# EAGLE schematic main (EAGLE 6.6.0)
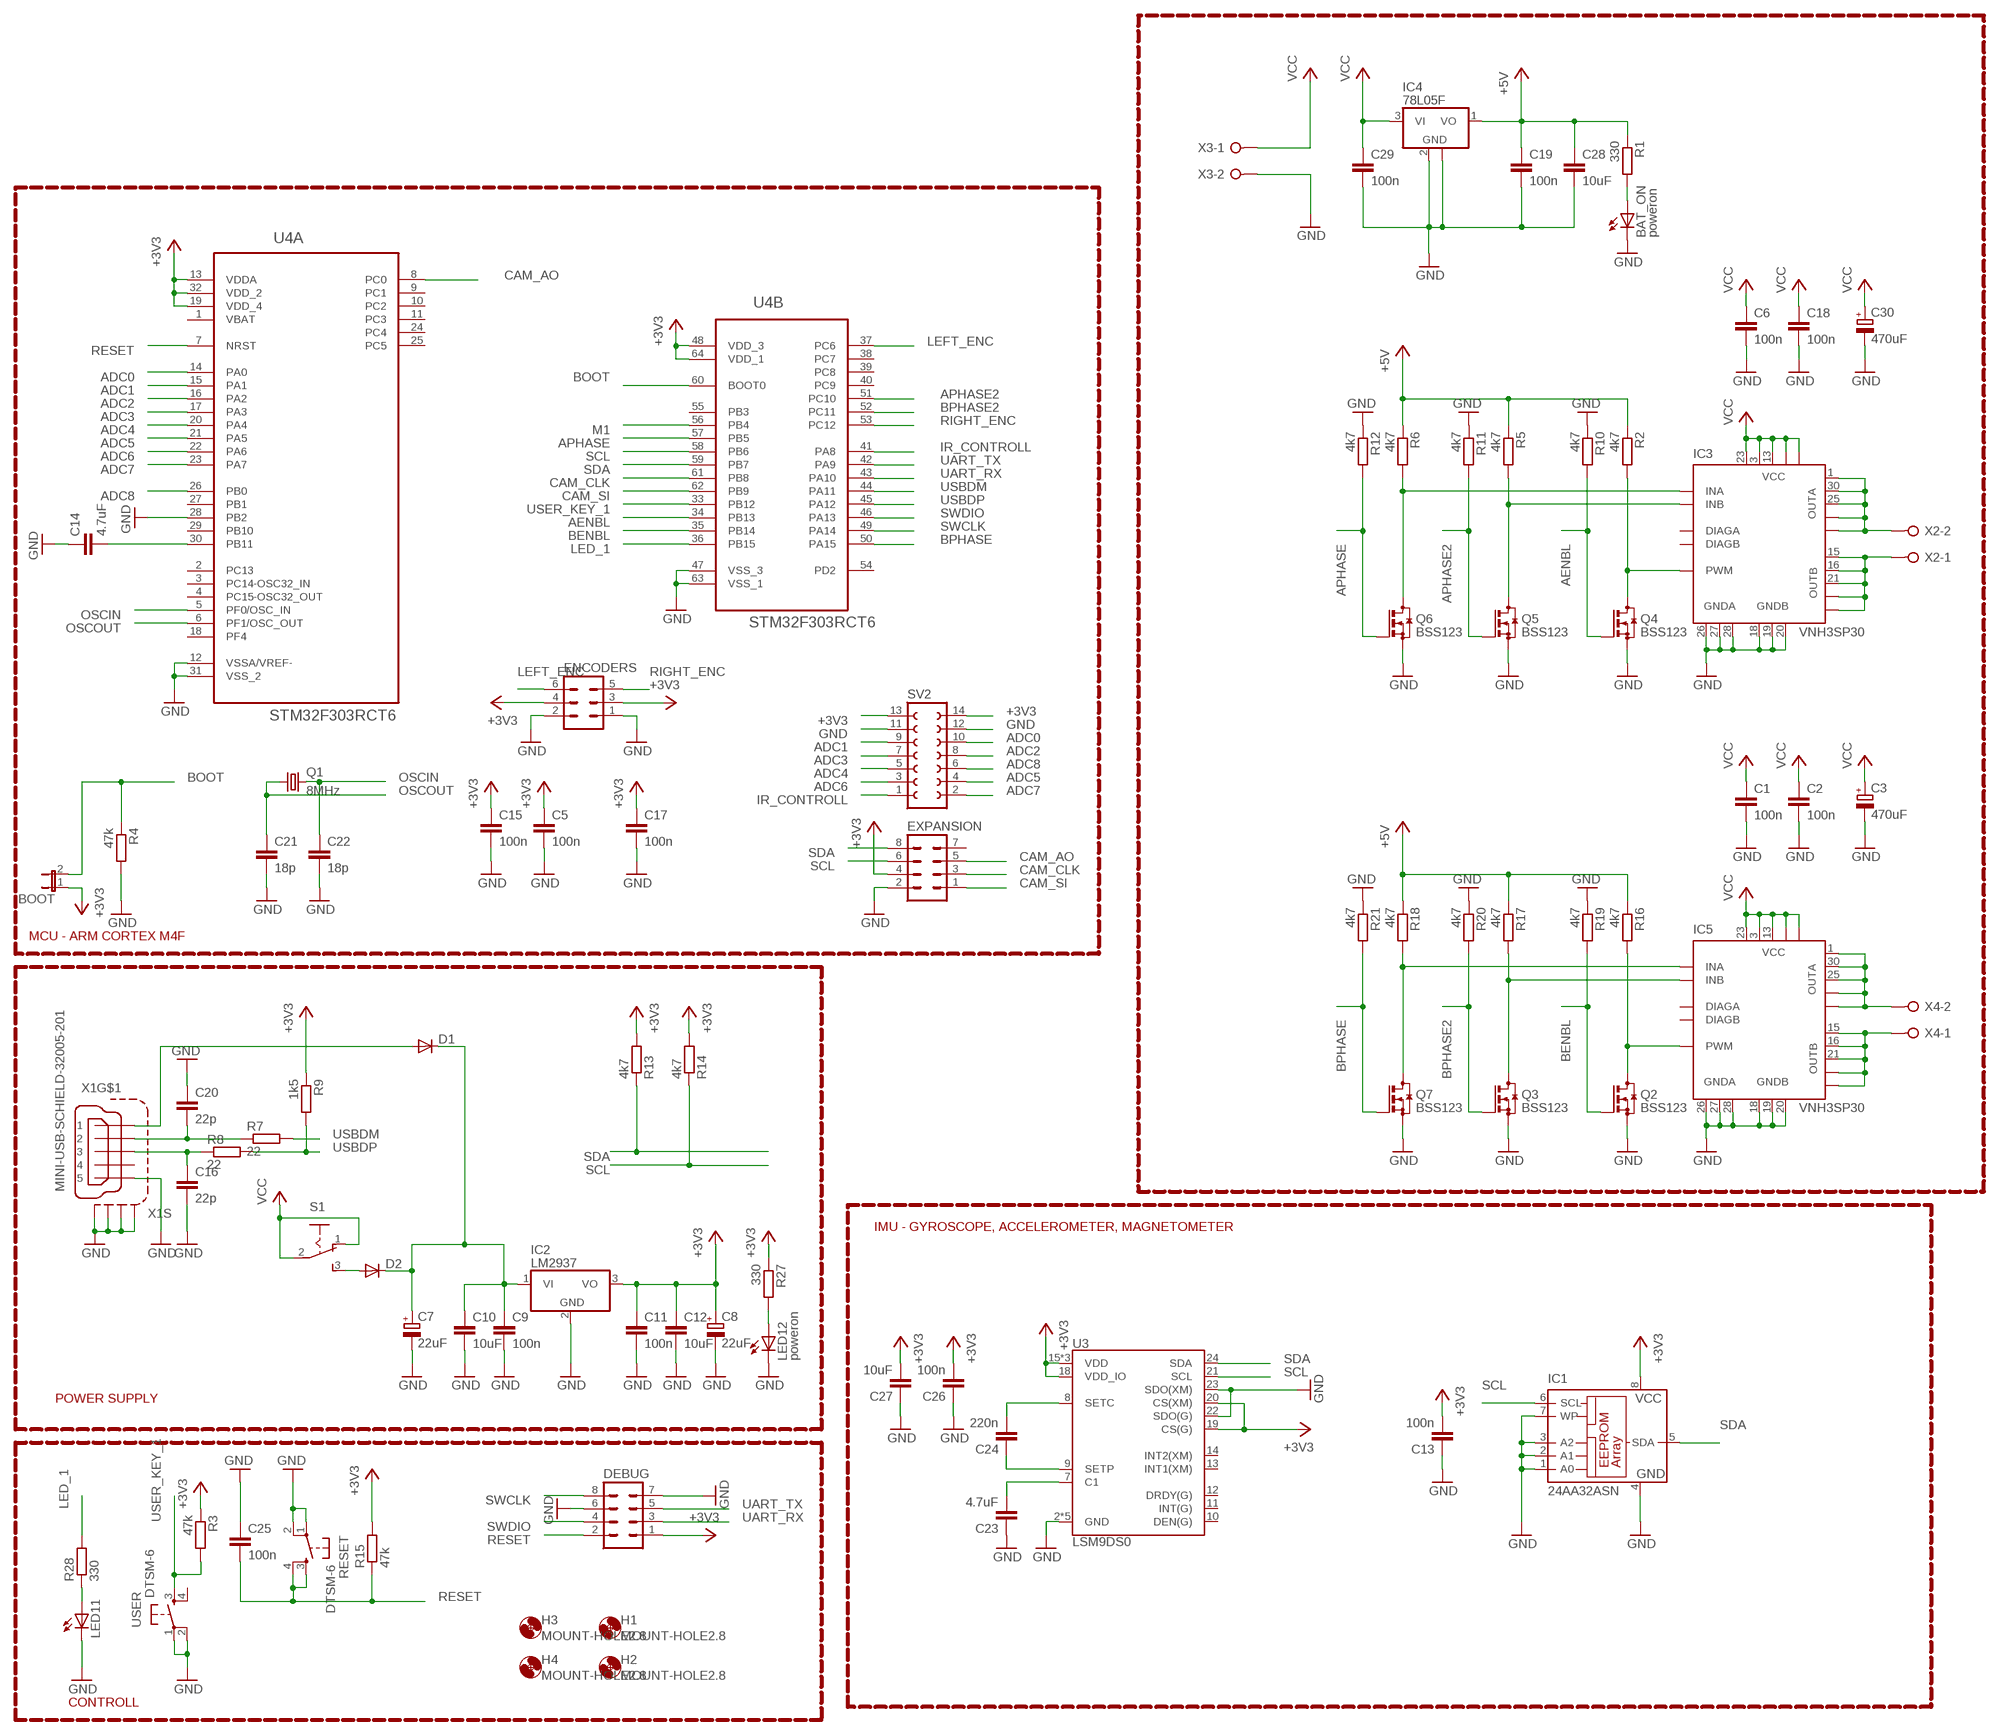
[diagram p0: schematic, sheet 1]

## Parts
BAT_ON  poweron  LEDCHIPLED_1206  [CHIPLED_1206]
BOOT  JP1E  [JP1]
C1  100n  C-EUC0805  [C0805]
C2  100n  C-EUC0805  [C0805]
C3  470uF  CPOL-EU140CLH-1014  [140CLH-1014]
C5  100n  C-EUC0805  [C0805]
C6  100n  C-EUC0805  [C0805]
C7  22uF  CPOL-EU153CLV-0505  [153CLV-0505]
C8  22uF  CPOL-EU153CLV-0505  [153CLV-0505]
C9  100n  C-EUC0805  [C0805]
C10  10uF  C-EUC0805  [C0805]
C11  100n  C-EUC0805  [C0805]
C12  10uF  C-EUC0805  [C0805]
C13  100n  C-EUC0805  [C0805]
C14  4.7uF  C-EUC0805  [C0805]
C15  100n  C-EUC0805  [C0805]
C16  22p  C-EUC0805  [C0805]
C17  100n  C-EUC0805  [C0805]
C18  100n  C-EUC0805  [C0805]
C19  100n  C-EUC0805  [C0805]
C20  22p  C-EUC0805  [C0805]
C21  18p  C-EUC0805  [C0805]
C22  18p  C-EUC0805  [C0805]
C23  4.7uF  C-EUC0805  [C0805]
C24  220n  C-EUC0805  [C0805]
C25  100n  C-EUC0805  [C0805]
C26  100n  C-EUC0805  [C0805]
C27  10uF  C-EUC0805  [C0805]
C28  10uF  C-EUC0805  [C0805]
C29  100n  C-EUC0805  [C0805]
C30  470uF  CPOL-EU140CLH-1014  [140CLH-1014]
D1  DIODE-SMB  [SMB]
D2  DIODE-SMB  [SMB]
DEBUG  MA04-2  [MA04-2]
ENCODERS  MA03-2  [MA03-2]
EXPANSION  MA04-2  [MA04-2]
H1  MOUNT-HOLE2.8  [2,8]
H2  MOUNT-HOLE2.8  [2,8]
H3  MOUNT-HOLE2.8  [2,8]
H4  MOUNT-HOLE2.8  [2,8]
IC1  24AA32ASN  [SO-08]
IC2  LM2937  [TO263-3]
IC3  VNH3SP30  [MULTIPOWERSO-30]
IC4  78L05F  [SOT89]
IC5  VNH3SP30  [MULTIPOWERSO-30]
LED11  LEDCHIPLED_1206  [CHIPLED_1206]
LED12  poweron  LEDCHIPLED_1206  [CHIPLED_1206]
Q1  8MHz  CRYSTALCTS406  [CTS406]
Q2  BSS123  [SOT23]
Q3  BSS123  [SOT23]
Q4  BSS123  [SOT23]
Q5  BSS123  [SOT23]
Q6  BSS123  [SOT23]
Q7  BSS123  [SOT23]
R1  330  R-EU_M0805  [M0805]
R2  4k7  R-EU_M0805  [M0805]
R3  47k  R-EU_M0805  [M0805]
R4  47k  R-EU_M0805  [M0805]
R5  4k7  R-EU_M0805  [M0805]
R6  4k7  R-EU_M0805  [M0805]
R7  22  R-EU_M0805  [M0805]
R8  22  R-EU_M0805  [M0805]
R9  1k5  R-EU_M0805  [M0805]
R10  4k7  R-EU_M0805  [M0805]
R11  4k7  R-EU_M0805  [M0805]
R12  4k7  R-EU_M0805  [M0805]
R13  4k7  R-EU_M0805  [M0805]
R14  4k7  R-EU_M0805  [M0805]
R15  47k  R-EU_M0805  [M0805]
R16  4k7  R-EU_M0805  [M0805]
R17  4k7  R-EU_M0805  [M0805]
R18  4k7  R-EU_M0805  [M0805]
R19  4k7  R-EU_M0805  [M0805]
R20  4k7  R-EU_M0805  [M0805]
R21  4k7  R-EU_M0805  [M0805]
R27  330  R-EU_M0805  [M0805]
R28  330  R-EU_M0805  [M0805]
RESET  DTSM-6  [DTSM-6]
S1  255SB  [255SB]
SV2  FE07-2  [FE07-2]
U3  LSM9DS0  [LGA-24]
U4  STM32F303RCT6  [QFP50P1200X1200X160-64N]
USER  DTSM-6  [DTSM-6]
X1  MINI-USB-SCHIELD-32005-201  [32005-201]
X2  W237-02P  [W237-132]
X3  W237-02P  [W237-132]
X4  W237-02P  [W237-132]

## Nets
+3V3: BOOT.1 C5.1 C8.+ C11.1 C12.1 C13.2 C15.1 C17.1 C26.2 C27.2 DEBUG.1 ENCODERS.3 ENCODERS.4 EXPANSION.4 IC1.8(VCC) IC2.3(VO) R3.1 R9.1 R13.2 R14.2 R15.2 R27.1 SV2.13 SV2.14 U3.15(VDD) U3.16(VDD) U3.17(VDD) U3.18(VDD_IO) U3.19(CS(G)) U3.20(CS(XM)) U4.13(A:VDDA) U4.19(A:VDD_4) U4.32(A:VDD_2) U4.48(B:VDD_3) U4.64(B:VDD_1)
+5V: C19.1 C28.1 IC4.1(VO) R1.1 R2.1 R5.1 R6.1 R16.1 R17.1 R18.1
ADC0: SV2.10 U4.14(A:PA0)
ADC1: SV2.9 U4.15(A:PA1)
ADC2: SV2.8 U4.16(A:PA2)
ADC3: SV2.7 U4.17(A:PA3)
ADC4: SV2.5 U4.20(A:PA4)
ADC5: SV2.4 U4.21(A:PA5)
ADC6: SV2.3 U4.22(A:PA6)
ADC7: SV2.2 U4.23(A:PA7)
ADC8: SV2.6 U4.26(A:PB0)
AENBL: Q4.1(G) R10.2 U4.34(B:PB13)
APHASE: Q6.1(G) R12.2 U4.57(B:PB5)
APHASE2: Q5.1(G) R11.2 U4.51(B:PC10)
BENBL: Q2.1(G) R19.2 U4.35(B:PB14)
BOOT: BOOT.2 R4.1 U4.60(B:BOOT0)
BPHASE: Q7.1(G) R21.2 U4.50(B:PA15)
BPHASE2: Q3.1(G) R20.2 U4.52(B:PC11)
CAM_AO: EXPANSION.5 U4.8(A:PC0)
CAM_CLK: EXPANSION.3 U4.61(B:PB8)
CAM_SI: EXPANSION.1 U4.62(B:PB9)
GND: BAT_ON.C C1.2 C2.2 C3.- C5.2 C6.2 C7.- C8.- C9.2 C10.2 C11.2 C12.2 C13.1 C14.1 C15.2 C16.2 C17.2 C18.2 C19.2 C20.1 C21.2 C22.2 C23.1 C25.1 C26.1 C27.1 C28.2 C29.2 C30.- DEBUG.6 DEBUG.7 ENCODERS.1 ENCODERS.2 EXPANSION.2 IC1.1(A0) IC1.2(A1) IC1.3(A2) IC1.4(GND) IC1.7(WP) IC2.2(GND) IC3.18(GNDB) IC3.19(GNDB) IC3.20(GNDB) IC3.26(GNDA) IC3.27(GNDA) IC3.28(GNDA) IC4.2(GND) IC4.2@1(GND) IC5.18(GNDB) IC5.19(GNDB) IC5.20(GNDB) IC5.26(GNDA) IC5.27(GNDA) IC5.28(GNDA) LED11.C LED12.C Q2.2(S) Q3.2(S) Q4.2(S) Q5.2(S) Q6.2(S) Q7.2(S) R4.2 R10.1 R11.1 R12.1 R19.1 R20.1 R21.1 RESET.1 RESET.2 SV2.11 SV2.12 U3.2(GND) U3.3(GND) U3.4(GND) U3.5(GND) U3.6(GND) U3.22(SDO(G)) U3.23(SDO(XM)) U4.12(A:VSSA/VREF-) U4.28(A:PB2) U4.31(A:VSS_2) U4.47(B:VSS_3) U4.63(B:VSS_1) USER.1 USER.2 X1.5 X1.M1(S:S1) X1.M2(S:S2) X1.M3(S:S3) X1.M4(S:S4) X3.2
IR_CONTROLL: SV2.1 U4.41(B:PA8)
LED_1: R28.2 U4.36(B:PB15)
LEFT_ENC: ENCODERS.6 U4.37(B:PC6)
M1: U4.56(B:PB4)
N$1: D2.A S1.3(S)
N$2: C7.+ C9.1 C10.1 D1.C D2.C IC2.1(VI)
N$3: BAT_ON.A R1.2
N$4: IC5.5(INA) Q7.3(D) R18.2
N$5: IC5.11(INB) Q3.3(D) R17.2
N$6: C23.2 U3.7(C1)
N$7: C24.2 U3.8(SETC)
N$8: IC5.8(PWM) Q2.3(D) R16.2
N$9: IC5.1(OUTA) IC5.25(OUTA) IC5.30(OUTA) IC5.OUTA IC5.OUTA@1(OUTA) X4.2
N$13: C24.1 U3.9(SETP)
N$14: IC5.15(OUTB) IC5.16(OUTB) IC5.21(OUTB) IC5.OUTB IC5.OUTB@1(OUTB) X4.1
N$15: C14.2 U4.30(A:PB11)
N$18: IC3.5(INA) Q6.3(D) R6.2
N$19: IC3.11(INB) Q5.3(D) R5.2
N$20: IC3.8(PWM) Q4.3(D) R2.2
N$21: IC3.1(OUTA) IC3.25(OUTA) IC3.30(OUTA) IC3.OUTA IC3.OUTA@1(OUTA) X2.2
N$23: LED12.A R27.2
N$24: IC3.15(OUTB) IC3.16(OUTB) IC3.21(OUTB) IC3.OUTB IC3.OUTB@1(OUTB) X2.1
N$33: LED11.A R28.1
N$55: C20.2 R7.1 X1.2
N$56: C16.1 R8.1 X1.3
N$57: D1.A X1.1
OSCIN: C22.1 Q1.3 U4.5(A:PF0/OSC_IN)
OSCOUT: C21.1 Q1.1 U4.6(A:PF1/OSC_OUT)
RESET: C25.2 DEBUG.2 R15.1 RESET.3 RESET.4 U4.7(A:NRST)
RIGHT_ENC: ENCODERS.5 U4.53(B:PC12)
SCL: EXPANSION.6 IC1.6(SCL) R14.1 U3.21(SCL) U4.58(B:PB6)
SDA: EXPANSION.8 IC1.5(SDA) R13.1 U3.24(SDA) U4.59(B:PB7)
SWCLK: DEBUG.8 U4.49(B:PA14)
SWDIO: DEBUG.4 U4.46(B:PA13)
UART_RX: DEBUG.3 U4.43(B:PA10)
UART_TX: DEBUG.5 U4.42(B:PA9)
USBDM: R7.2 U4.44(B:PA11)
USBDP: R8.2 R9.2 U4.45(B:PA12)
USER_KEY_1: R3.2 U4.33(B:PB12) USER.3
VCC: C1.1 C2.1 C3.+ C6.1 C18.1 C29.1 C30.+ IC3.3(VCC) IC3.13(VCC) IC3.23(VCC) IC3.VCC IC3.VCC@1(VCC) IC4.3(VI) IC5.3(VCC) IC5.13(VCC) IC5.23(VCC) IC5.VCC IC5.VCC@1(VCC) S1.1(O) S1.2(P) X3.1
Unconnected: EXPANSION.7 IC3.6(DIAGA) IC3.10(DIAGB) IC5.6(DIAGA) IC5.10(DIAGB) U3.10(DEN(G)) U3.11(INT(G)) U3.12(DRDY(G)) U3.13(INT1(XM)) U3.14(INT2(XM)) U4.2(A:PC13) U4.3(A:PC14-OSC32_IN) U4.4(A:PC15-OSC32_OUT) U4.9(A:PC1) U4.10(A:PC2) U4.11(A:PC3) U4.18(A:PF4) U4.24(A:PC4) U4.25(A:PC5) U4.27(A:PB1) U4.29(A:PB10) U4.38(B:PC7) U4.39(B:PC8) U4.40(B:PC9) U4.54(B:PD2) U4.55(B:PB3) USER.4 X1.4

## Notes on the sheet
- MCU - ARM CORTEX M4F
- IMU - GYROSCOPE, ACCELEROMETER, MAGNETOMETER
- POWER SUPPLY
- CONTROLL

## Power pins joined to a net without a drawn wire
VBAT: U4.1(A:VBAT)

## Library data of the parts
BAT_ON LED11 LED12 = led:LED: LED OSRAM: - CHIPLED LG R971, LG N971, LY N971, LG Q971, LY Q971, LO R971, LY R971 LH N974, LH R974 LS Q976, LO Q976, LY Q976 LO Q996 - Hyper CHIPLED LW Q18S LB Q993, LB Q99A, LB R99A - SideLED LS A670, LO A670, LY A670, LG A670, LP A670 LB A673, LV A673, LT A673, LW A673 LH A674 LY A675 LS A676, LA A676, LO A676, LY A676, LW A676 LS A679, LY A679, LG A679 - Hyper Micro SIDELED® LS Y876, LA Y876, LO Y876, LY Y876 LT Y87S - SmartLED LW L88C, LW L88S LB L89C, LB L89S, LG L890 LS L89K, LO L89K, LY L89K LS L896, LA L896, LO L896, LY L896 - TOPLED LS T670, LO T670, LY T670, LG T670, LP T670 LSG T670, LSP T670, LSY T670, LOP T670, LYG T670 LG T671, LOG T671, LSG T671 LB T673, LV T673, LT T673, LW T673 LH T674 LS T676, LA T676, LO T676, LY T676, LB T676, LH T676, LSB T676, LW T676 LB T67C, LV T67C, LT T67C, LS T67K, LO T67K, LY T67K, LW E67C LS E67B, LA E67B, LO E67B, LY E67B, LB E67C, LV E67C, LT E67C LW T67C LS T679, LY T679, LG T679 LS T770, LO T770, LY T770, LG T770, LP T770 LB T773, LV T773, LT T773, LW T773 LH T774 LS E675, LA E675, LY E675, LS T675 LS T776, LA T776, LO T776, LY T776, LB T776 LHGB T686 LT T68C, LB T68C - Hyper Mini TOPLED® LB M676 - Mini TOPLED Santana® LG M470 LS M47K, LO M47K, LY M47K Source: http://www.osram.convergy.de LUXEON: - LUMILED® LXK2-PW12-R00, LXK2-PW12-S00, LXK2-PW14-U00, LXK2-PW14-V00 LXK2-PM12-R00, LXK2-PM12-S00, LXK2-PM14-U00 LXK2-PE12-Q00, LXK2-PE12-R00, LXK2-PE12-S00, LXK2-PE14-T00, LXK2-PE14-U00 LXK2-PB12-K00, LXK2-PB12-L00, LXK2-PB12-M00, LXK2-PB14-N00, LXK2-PB14-P00, LXK2-PB14-Q00 LXK2-PR12-L00, LXK2-PR12-M00, LXK2-PR14-Q00, LXK2-PR14-R00 LXK2-PD12-Q00, LXK2-PD12-R00, LXK2-PD12-S00 LXK2-PH12-R00, LXK2-PH12-S00 LXK2-PL12-P00, LXK2-PL12-Q00, LXK2-PL12-R00 Source: www.luxeon.com KINGBRIGHT: KA-3528ASYC Source: www.kingbright.com
BOOT = jumper:JP1E: JUMPER
C1 C2 C5 C6 C9-C29 = resistor:C-EU: CAPACITOR, European symbol
C3 C7 C8 C30 = resistor:CPOL-EU: POLARIZED CAPACITOR, European symbol
D1 D2 = diode:DIODE-: DIODE
DEBUG EXPANSION = con-lstb:MA04-2: PIN HEADER; OC_FARNELL: unknown; OC_NEWARK: unknown
ENCODERS = con-lstb:MA03-2: PIN HEADER; OC_FARNELL: unknown; OC_NEWARK: unknown
H1-H4 = holes:MOUNT-HOLE: MOUNTING HOLE with drill center marker
IC1 = microchip:24*: Serial EEPROM I2C; MF: MICROCHIP; MPN: 24AA32A-I/SN; OC_FARNELL: 1617659; OC_NEWARK: 83C5815
IC2 = linear:LM2937: LM2937-2.5, LM2937-3.3 400mA and 500mA Voltage Regulators Source: http://cache.national.com/ds/LM/LM2937-2.5.pdf
IC3 IC5 = st-microelectronics:VNH3SP30: FULLY INTEGRATED H-BRIDGE MOTOR DRIVER Source: http://pdf1.alldatasheet.com/datasheet-pdf/view/84563/STMICROELECTRONICS/VNH3SP30.html; MPN: VNH3SP30-E; OC_FARNELL: 1739420; OC_NEWARK: 33R1486
IC4 = linear:78L*: POSITOIV-VOLTAGE REGULATORS Output up to 100 mA Source: Datasheet <http://focus.ti.com/lit/ds/symlink/ua78l05.pdf>
Q1 = crystal:CRYSTAL: CRYSTAL; OC_FARNELL: unknown; OC_NEWARK: unknown
Q2-Q7 = transistor-small-signal:BSS123: N-CHANNEL MOS FET
R1-R21 R27 R28 = resistor:R-EU_: RESISTOR, European symbol
RESET USER = switch-tact:DTSM-6
S1 = switch:255SB: SLIDING SWITCH Distributor Buerklin, 11G810
SV2 = con-lsta:FE07-2: FEMALE HEADER; OC_FARNELL: unknown; OC_NEWARK: unknown
U3 = SparkFun-DigitalIC:LSM9DS0: LSM9DS0 3D Accelerometer, 3D Gyroscope, 3D Magnetomter Features: 3 acceleration channels, 3 angular rate channels, 3 magnetic field channels ±2/±4/±6/±8/±16 g linear acceleration full scale ±2/±4/±8/±12 gauss magnetic full scale ±245/±500/±2000 dps angular rate full scale 16-bit data output SPI / I2C serial interfaces Analog supply voltage 2.4 V to 3.6 V Power-down mode / low-power mode Programmable interrupt generators Embedded self-test Embedded temperature sensor Embedded FIFO Position and motion detection functions Click/double-click recognition
U4 = my_parts:STM32F303RCT6: ARM Cortex-M4 32b MCU+FPU,LQFP-64; MPN: STM32F303RCT6; OC_FARNELL: 2215112; OC_NEWARK: 46W2193; PACKAGE: LQFP-64; SUPPLIER: STMICROELECTRONICS
X1 = con-cypressindustries:MINI-USB-SCHIELD-: MINI USB-B Conector Source: www.cypressindustries.com; OC_FARNELL: unknown; OC_NEWARK: unknown
X2-X4 = con-wago-508:W237-02P: WAGO SREW CLAMP; OC_FARNELL: unknown; OC_NEWARK: unknown